# EasyEDA schematic SCH_relay-based-x-mas-lights_2021-08-14.json
TITLE: Relay controller; REV: 1.0; Date: 2021-08-11; Sheet: 1/1; Drawn By: msrameshp; Company: Ramesh  Perera
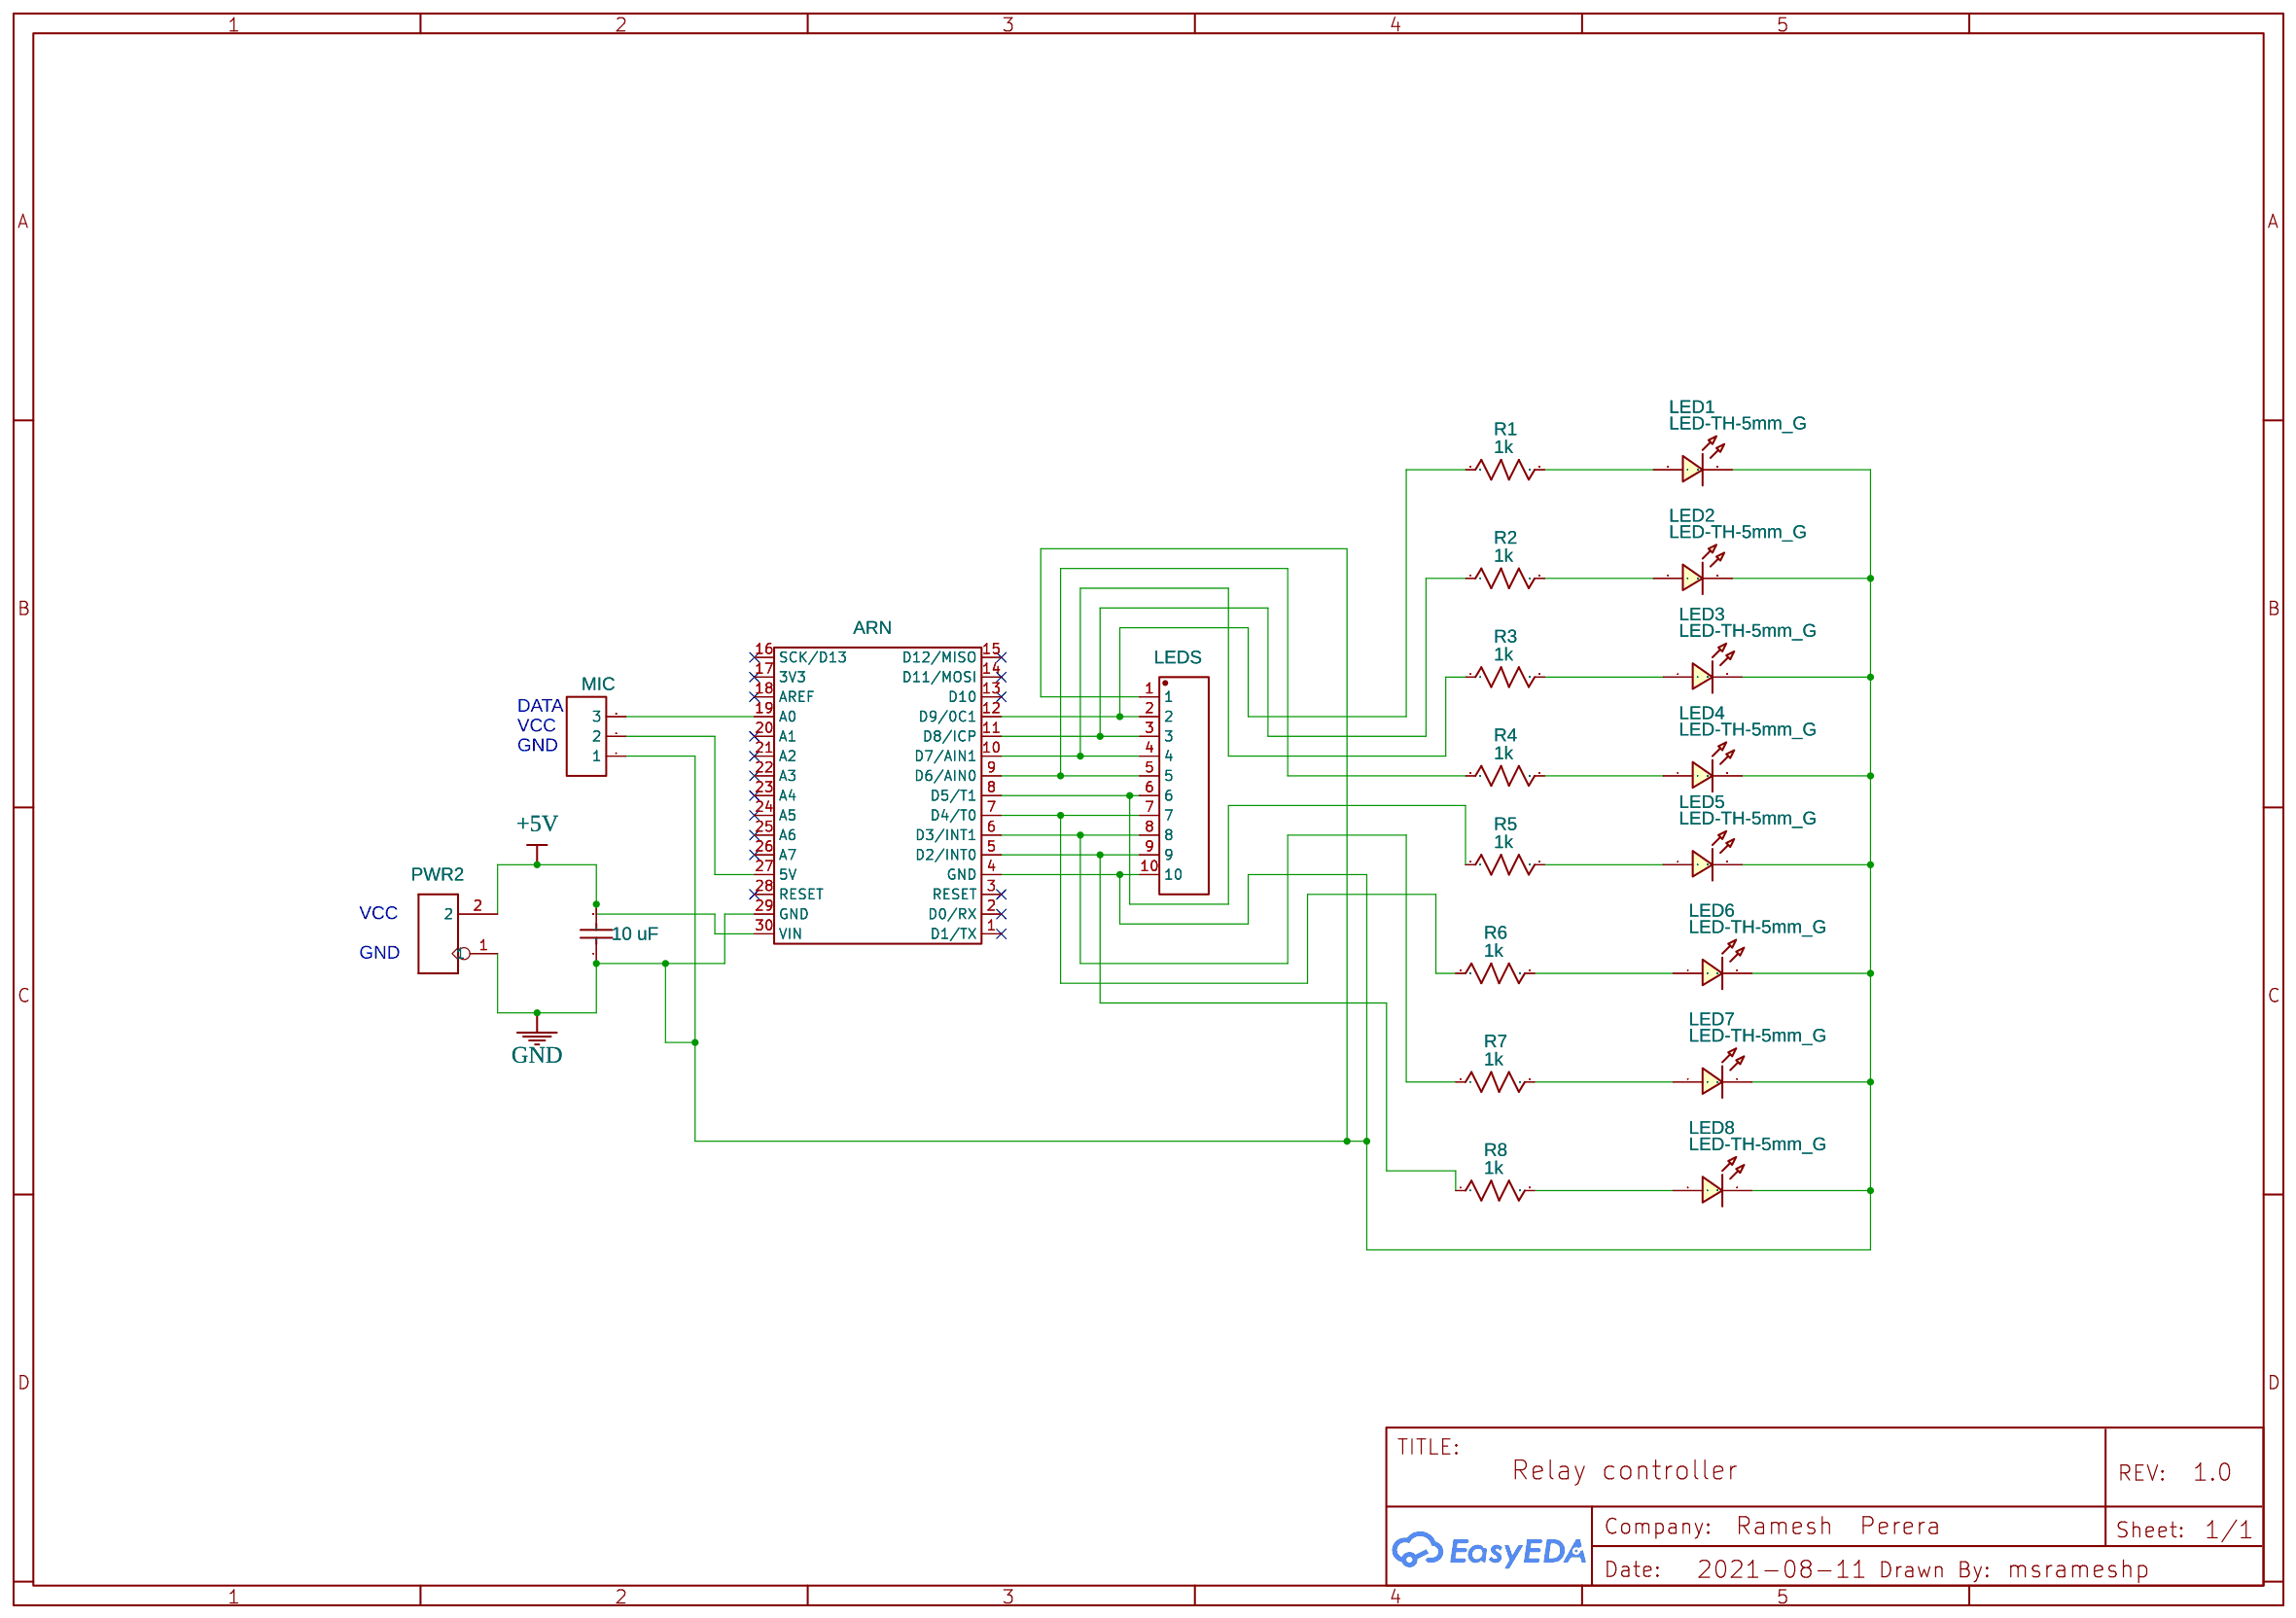
[diagram p0: schematic sheet]

## Parts
ARN  Arduino_Nano_Header  [DIP-30_L43.18-W15.24-ARDUINONANO]
C2  10 uF  [CAP-TH_L5.0-W4.0-P5.00-D1.0]
LED1  LED-TH-5mm_G  [LED-TH_BD5.0_GREEN]
LED2  LED-TH-5mm_G  [LED-TH_BD5.0_GREEN]
LED3  LED-TH-5mm_G  [LED-TH_BD5.0_GREEN]
LED4  LED-TH-5mm_G  [LED-TH_BD5.0_GREEN]
LED5  LED-TH-5mm_G  [LED-TH_BD5.0_GREEN]
LED6  LED-TH-5mm_G  [LED-TH_BD5.0_GREEN]
LED7  LED-TH-5mm_G  [LED-TH_BD5.0_GREEN]
LED8  LED-TH-5mm_G  [LED-TH_BD5.0_GREEN]
LEDS  Header-Male-2.54_1x10  [HDR-TH_10P-P2.54-V-M-1]
MIC1  MIC  [HDR-TH_3P-P2.54-V-M-1]
PWR2  PWR  [H2-2.54]
R1  1k  [R_AXIAL-0.3]
R2  1k  [R_AXIAL-0.3]
R3  1k  [R_AXIAL-0.3]
R4  1k  [R_AXIAL-0.3]
R5  1k  [R_AXIAL-0.3]
R6  1k  [R_AXIAL-0.3]
R7  1k  [R_AXIAL-0.3]
R8  1k  [R_AXIAL-0.3]

## Library data of the parts
ARN = Arduino_Nano_Header
C2 = Ceramic capacitors47PF 3KV: Supplier: LCSC; Manufacturer: ReliaPro; Supplier Part: C19375
LED1-LED8 = LED-TH-5mm_G: Manufacturer: EVERLIGHT(台湾亿光); Manufacturer Part: 333-2SYGD/S530-E2; Supplier Part: C88163; Supplier: LCSC; Contributor: LCEDA_Lib
LEDS = Header-Male-2.54_1x10: Supplier: LCSC; Manufacturer Part: Headers  Pins2.54mm1*10P; Supplier Part: C57369; JLCPCB Part Class: Extended Part
MIC1 = Header-Male-2.54_1x3: Supplier: LCSC; Manufacturer: BOOMELE; Manufacturer Part: Header2.54mm 1*3P; Supplier Part: C49257; JLCPCB Part Class: Extended Part
PWR2 = P125-1102A0BS116A2: DIP Blue Male Header VERT
R1-R8 = R_AXIAL-0.3_US: Contributor: LCEDA_Lib

## Nets
+5V: ARN.30(VIN) C2.2 PWR2.2
GND: ARN.4(GND) ARN.29(GND) C2.1 LED1.2 LED2.2 LED3.2 LED4.2 LED5.2 LED6.2 LED7.2 LED8.2 LEDS.1 LEDS.10 MIC1.1 PWR2.1
Net-(ARN-5): ARN.5(D2/INT0) LEDS.9 R8.1
Net-(ARN-6): ARN.6(D3/INT1) LEDS.8 R7.1
Net-(ARN-7): ARN.7(D4/T0) LEDS.7 R6.1
Net-(ARN-8): ARN.8(D5/T1) LEDS.6 R5.1
Net-(ARN-9): ARN.9(D6/AIN0) LEDS.5 R4.1
Net-(ARN-10): ARN.10(D7/AIN1) LEDS.4 R3.1
Net-(ARN-11): ARN.11(D8/ICP) LEDS.3 R2.1
Net-(ARN-12): ARN.12(D9/0C1) LEDS.2 R1.1
Net-(ARN-19): ARN.19(A0) MIC1.3
Net-(ARN-27): ARN.27(5V) MIC1.2
Net-(LED1-1): LED1.1 R1.2
Net-(LED2-1): LED2.1 R2.2
Net-(LED3-1): LED3.1 R3.2
Net-(LED4-1): LED4.1 R4.2
Net-(LED5-1): LED5.1 R5.2
Net-(LED6-1): LED6.1 R6.2
Net-(LED7-1): LED7.1 R7.2
Net-(LED8-1): LED8.1 R8.2

Not connected (* = marked no-connect by the designer): ARN 1(D1/TX)* 2(D0/RX)* 3(RESET)* 13(D10)* 14(D11/MOSI)* 15(D12/MISO)* 16(SCK/D13)* 17(3V3)* 18(AREF)* 20(A1)* 21(A2)* 22(A3)* 23(A4)* 24(A5)* 25(A6)* 26(A7)* 28(RESET)*

## Notes on the sheet
- DATA
- VCC
- GND
- VCC
- GND
